# EAGLE design 89c2051-sun-ps2 (EAGLE 4.16)
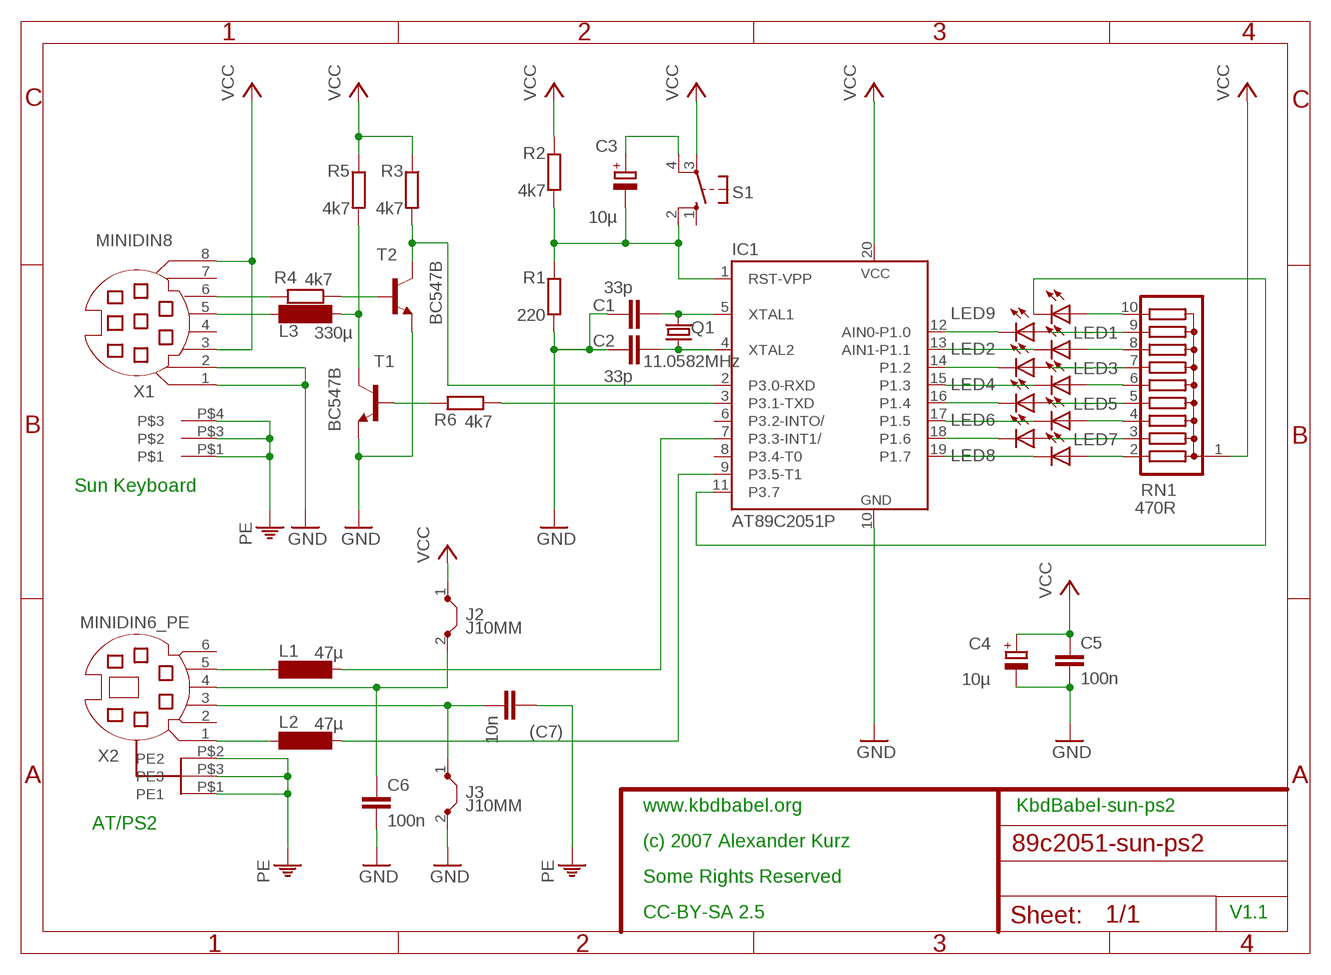
[diagram p0: schematic, sheet 1]

## Parts
(C7)  10n  C-EU025_050-025X075  [C025_050-025X075]
C1  33p  C-EU025-030X050  [C025-030X050]
C2  33p  C-EU025-030X050  [C025-030X050]
C3  10µ  CPOL-EUE2-5  [E2-5]
C4  10µ  CPOL-EUE2-5  [E2-5]
C5  100n  C-EU025_050-025X075  [C025_050-025X075]
C6  100n  C-EU025_050-025X075  [C025_050-025X075]
IC1  AT89C2051P  [DIL20]
J2  J10MM  [10]
J3  J10MM  [10]
L1  47µ  SD75  [SD75]
L2  47µ  SD75  [SD75]
L3  330µ  SD75  [SD75]
LED1  LEDSQR2X5  [LED2X5]
LED2  LEDSQR2X5  [LED2X5]
LED3  LEDSQR2X5  [LED2X5]
LED4  LEDSQR2X5  [LED2X5]
LED5  LEDSQR2X5  [LED2X5]
LED6  LEDSQR2X5  [LED2X5]
LED7  LEDSQR2X5  [LED2X5]
LED8  LEDSQR2X5  [LED2X5]
LED9  LEDSQR2X5  [LED2X5]
Q1  11.0582MHz  CRYSTALHC49U70  [HC49U70]
R1  220  R-EU_0204/7  [0204/7]
R2  4k7  R-EU_0204/7  [0204/7]
R3  4k7  R-EU_0204/7  [0204/7]
R4  4k7  R-EU_0204/7  [0204/7]
R5  4k7  R-EU_0204/7  [0204/7]
R6  4k7  R-EU_0204/7  [0204/7]
RN1  470R  G09R  [SIL10]
S1  10-XX  [B3F-10XX]
T1  BC547B  [TO92]
T2  BC547B  [TO92]
X1  MINIDIN8  [MINIDIN8]
X2  MINIDIN6_PE  [MINIDIN6_PE]

## Nets
GND: C1.1 C2.2 C4.- C5.2 C6.2 IC1.10(GND) J3.2 R1.2 T1.1(E) T2.1(E) X1.1 X1.2
N$1: C1.2 IC1.5(XTAL1) Q1.2
N$2: C2.1 IC1.4(XTAL2) Q1.1
N$3: L1.1 X2.5
N$4: LED1.A RN1.9
N$5: IC1.17(P1.5) LED6.K(C)
N$6: IC1.3(P3.1-TXD) R6.1
N$7: (C7).2 J3.1 X2.3
N$8: IC1.12(AIN0-P1.0) LED1.K(C)
N$9: C3.- IC1.1(RST-VPP) R1.1 R2.2 S1.2(S1)
N$10: C6.1 J2.2 X2.4
N$11: IC1.7(P3.3-INT1/) L1.2
N$12: IC1.9(P3.5-T1) L2.2
N$13: IC1.13(AIN1-P1.1) LED2.K(C)
N$14: LED3.A RN1.7
N$15: IC1.15(P1.3) LED4.K(C)
N$16: LED5.A RN1.5
N$17: LED2.A RN1.8
N$18: LED4.A RN1.6
N$19: LED6.A RN1.4
N$20: IC1.18(P1.6) LED7.K(C)
N$21: LED8.A RN1.2
N$22: LED7.A RN1.3
N$23: IC1.19(P1.7) LED8.K(C)
N$24: IC1.16(P1.4) LED5.K(C)
N$25: IC1.14(P1.2) LED3.K(C)
N$26: L2.1 X2.1
N$27: LED9.A RN1.10
N$28: IC1.11(P3.7) LED9.K(C)
N$29: R4.2 X1.6
N$30: R4.1 T2.2(B)
N$31: L3.1 X1.5
N$32: IC1.2(P3.0-RXD) R3.2 T2.3(C)
N$33: L3.2 R5.2 T1.3(C)
N$34: R6.2 T1.2(B)
N$36: C3.+ S1.4(P1)
PE: (C7).1 X1.P$1 X1.P$3 X1.P$4 X2.P$1(PE1) X2.P$2(PE2) X2.P$3(PE3)
VCC: C4.+ C5.1 IC1.20(VCC) J2.1 R2.1 R3.1 R5.1 RN1.1 S1.3(P) X1.3 X1.8
Unconnected: IC1.6(P3.2-INTO/) IC1.8(P3.4-T0) S1.1(S) X1.4 X1.7 X2.2 X2.6

## Notes on the sheet
- Sun Keyboard
- www.kbdbabel.org | KbdBabel-sun-ps2
- AT/PS2
- (c) 2007 Alexander Kurz
- Some Rights Reserved
- CC-BY-SA 2.5 | V1.1

## Library data of the parts
(C7) C1 C2 C5 C6 = rcl:C-EU: CAPACITOR, European symbol
C3 C4 = rcl:CPOL-EU: POLARIZED CAPACITOR, European symbol
IC1 = atmel:AT89C2051: 80C31 MICROCONTROLLER 2 Kbytes FLASH 2.7 V
J2 J3 = jumper:J: Bridge
L1-L3 = inductor-neosid:SD75: INDUCTOR nominal inductance, E12
LED1-LED9 = led:LED: LED OSRAM: - CHIPLED LG R971, LG N971, LY N971, LG Q971, LY Q971, LO R971, LY R971 LH N974, LH R974 LS Q976, LO Q976, LY Q976 LO Q996 - Hyper CHIPLED LW Q18S LB Q993, LB Q99A, LB R99A - SideLED LS A670, LO A670, LY A670, LG A670, LP A670 LB A673, LV A673, LT A673, LW A673 LH A674 LY A675 LS A676, LA A676, LO A676, LY A676, LW A676 LS A679, LY A679, LG A679 - Hyper Micro SIDELED® LS Y876, LA Y876, LO Y876, LY Y876 LT Y87S - SmartLED LW L88C, LW L88S LB L89C, LB L89S, LG L890 LS L89K, LO L89K, LY L89K LS L896, LA L896, LO L896, LY L896 - TOPLED LS T670, LO T670, LY T670, LG T670, LP T670 LSG T670, LSP T670, LSY T670, LOP T670, LYG T670 LG T671, LOG T671, LSG T671 LB T673, LV T673, LT T673, LW T673 LH T674 LS T676, LA T676, LO T676, LY T676, LB T676, LH T676, LSB T676, LW T676 LB T67C, LV T67C, LT T67C, LS T67K, LO T67K, LY T67K, LW E67C LS E67B, LA E67B, LO E67B, LY E67B, LB E67C, LV E67C, LT E67C LW T67C LS T679, LY T679, LG T679 LS T770, LO T770, LY T770, LG T770, LP T770 LB T773, LV T773, LT T773, LW T773 LH T774 LS E675, LA E675, LY E675, LS T675 LS T776, LA T776, LO T776, LY T776, LB T776 LHGB T686 LT T68C, LB T68C - Hyper Mini TOPLED® LB M676 - Mini TOPLED Santana® LG M470 LS M47K, LO M47K, LY M47K Source: http://www.osram.convergy.de - LUMILED® LXK2-PW12-R00, LXK2-PW12-S00, LXK2-PW14-U00, LXK2-PW14-V00 LXK2-PM12-R00, LXK2-PM12-S00, LXK2-PM14-U00 LXK2-PE12-Q00, LXK2-PE12-R00, LXK2-PE12-S00, LXK2-PE14-T00, LXK2-PE14-U00 LXK2-PB12-K00, LXK2-PB12-L00, LXK2-PB12-M00, LXK2-PB14-N00, LXK2-PB14-P00, LXK2-PB14-Q00 LXK2-PR12-L00, LXK2-PR12-M00, LXK2-PR14-Q00, LXK2-PR14-R00 LXK2-PD12-Q00, LXK2-PD12-R00, LXK2-PD12-S00 LXK2-PH12-R00, LXK2-PH12-S00 LXK2-PL12-P00, LXK2-PL12-Q00, LXK2-PL12-R00 Source: www.luxeon.com
Q1 = crystal:CRYSTAL: CRYSTAL
R1-R6 = rcl:R-EU_: RESISTOR, European symbol
RN1 = resistor-sil:G09R: SIL RESISTOR
S1 = switch-omron:10-XX: OMRON SWITCH
T1 T2 = transistor-npn:BC547*: NPN Transistor
X1 = bla:MINIDIN8
X2 = bla:MINIDIN6_PE

## Board
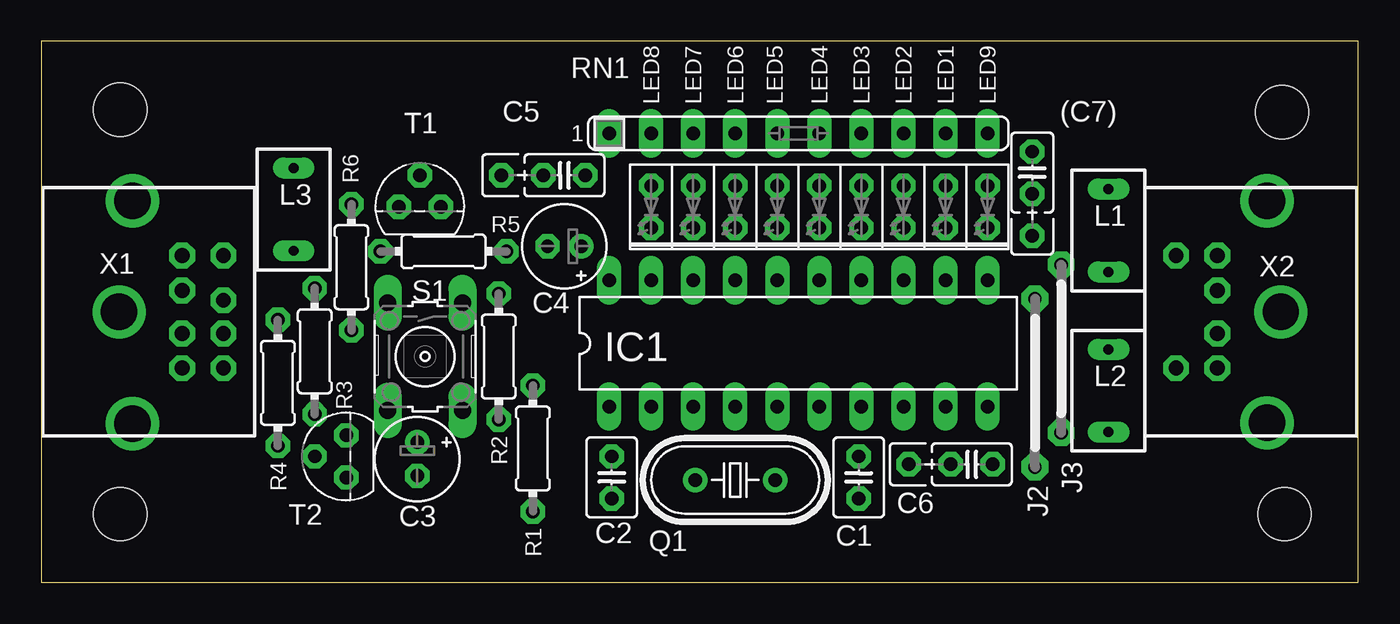
[diagram p1: board, top side]
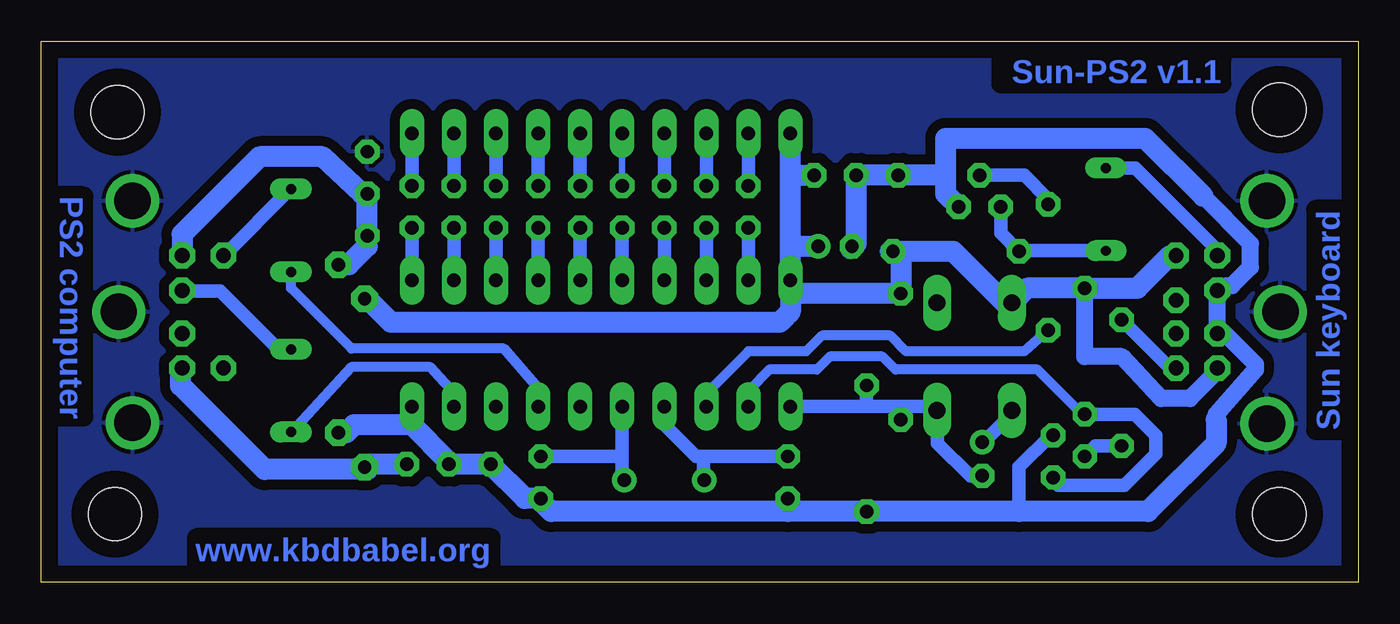
[diagram p2: board, bottom side, seen from below]

Size 79.52 x 32.69 mm. Coordinates in mm from the lower left corner, seen from the top.
Outline: 79.52,0 79.52,32.69 0,32.69 0,0 79.52,0
Copper layers (1*16): Top 0.035mm / dielectric 1.5mm / Bottom 0.035mm
Design rules "default": minimum track width 16mil, minimum drill 24mil, track to track 16mil, track to pad 16mil, pad to pad 16mil, via to via 16mil, smd to smd 16mil, copper to edge 40mil, drill to drill 8mil, minimum pad ring 13mil, minimum via ring 8mil, stop-mask expansion 4mil, vias tented up to drill 0mil, thermal gap 10mil
Holes 3.2 mm at 75.08,4.12 74.92,28.41 4.76,28.57 4.76,4.12

### Footprints (pad centres in the part's own frame; a part is rotated, then mirrored left to right if it is on the bottom)
C025_050-025X075 = drill 0.813 octagon: 1 -1.27,0; 2 1.27,0; 3 3.81,0
C025-030X050 = drill 0.813 octagon: 1 -1.27,0; 2 1.27,0
E2-5 = drill 0.813 pad 1.27 round: + -1.016,0 | drill 0.813 pad 1.27 octagon: - 1.016,0
DIL20 = drill 0.813 long: 1 -11.43,-3.81; 2 -8.89,-3.81; 3 -6.35,-3.81; 4 -3.81,-3.81; 5 -1.27,-3.81; 6 1.27,-3.81; 7 3.81,-3.81; 8 6.35,-3.81; 9 8.89,-3.81; 10 11.43,-3.81; 11 11.43,3.81; 12 8.89,3.81; 13 6.35,3.81; 14 3.81,3.81; 15 1.27,3.81; 16 -1.27,3.81; 17 -3.81,3.81; 18 -6.35,3.81; 19 -8.89,3.81; 20 -11.43,3.81
10 = drill 0.813 pad 1.6 octagon: 1 -5.08,0; 2 5.08,0
SD75 = drill 0.6 long: 1 -2.5,0; 2 2.5,0
LED2X5 = drill 0.813 octagon: A -1.27,0; K 1.27,0
HC49U70 = drill 0.813 round: 1 -2.413,0; 2 2.413,0
0204/7 = drill 0.813 octagon: 1 -3.81,0; 2 3.81,0
SIL10 = drill 0.813 long: 1 -11.43,0; 2 -8.89,0; 3 -6.35,0; 4 -3.81,0; 5 -1.27,0; 6 1.27,0; 7 3.81,0; 8 6.35,0; 9 8.89,0; 10 11.43,0
B3F-10XX = drill 1.016 long: 1 -3.251,2.261; 2 3.251,2.261; 3 -3.251,-2.261; 4 3.251,-2.261
TO92 = drill 0.813 octagon: 1 1.27,0; 2 0,1.905; 3 -1.27,0
MINIDIN8 = drill 0.9 octagon: 1 1.3,0.88; 2 -1.3,0.88; 3 3.4,0.88; 4 1.3,3.38; 5 -3.4,0.88; 6 3.4,3.38; 7 -0.7,3.38; 8 -3.4,3.38 | drill 2.2 round: P$1 -6.706,-2.108; P$3 0,-2.921; P$4 6.756,-2.108
MINIDIN6_PE = drill 0.9 octagon: 1 1.3,2.15; 2 -1.3,2.15; 3 3.4,2.15; 4 -3.4,2.15; 5 3.4,4.65; 6 -3.4,4.65 | drill 2.2 round: P$1 0,-1.676; P$2 -6.706,-0.838; P$3 6.706,-0.838

### Placement (x,y rotation side)
(C7)  59.84,24.76 270 top
C1  49.37,6.34 90 top
C2  34.44,6.34 270 top
C3  22.7,7.46 270 top
C4  31.59,20.31 180 top
C5  31.59,24.6 180 top
C6  56.19,7.14 180 top
IC1  45.71,14.44 0 top
J2  60,12.06 270 top
J3  61.59,14.12 270 top
L1  64.45,21.27 270 top
L2  64.45,11.58 270 top
L3  15.23,22.54 270 top
LED1  54.6,22.7 270 top
LED2  52.06,22.7 270 top
LED3  49.52,22.7 270 top
LED4  46.98,22.7 270 top
LED5  44.44,22.7 270 top
LED6  41.9,22.7 270 top
LED7  39.36,22.7 270 top
LED8  36.82,22.7 270 top
LED9  57.14,22.7 270 top
Q1  41.9,6.19 0 top
R1  29.68,8.09 270 top
R2  27.62,13.65 270 top
R3  16.5,13.96 270 top
R4  14.28,12.06 90 top
R5  24.28,20 180 top
R6  18.73,19.04 90 top
RN1  45.71,27.14 0 top
S1  23.17,13.65 270 top
T1  22.85,22.7 0 top
T2  18.41,7.61 90 top
X1  7.62,16.34 270 top
X2  73.18,16.34 90 top

### Tracks (layer width: path | path; a pad name or v marks a point on that pad's centre or on a via)
GND
  Bottom 0.813: T2.1 18.57,8.88 20.47,6.98 20.47,4.28
  Bottom 1.016: 9.36,23.33 | 9.36,23.33 6.5,20.47 6.5,19.04 7.61,17.93 7.93,17.93 8.41,17.46 8.49,17.54 X1.2 X1.1 | X1.1 8.49,14.99 8.57,14.92 | 8.57,9.84 8.57,10.15 6.19,12.85 6.19,13.17 8.09,15.07 8.12,15.04 X1.1
  Bottom 1.27: 57.14,9.52 IC1.10 | 49.52,5.07 50.32,5.07 52.38,7.14 C6.2 54.92,7.3 57.14,9.52 | J3.2 61.11,9.04 60.64,9.52 57.14,9.52 | 8.57,9.84 8.57,8.41 12.69,4.28 20.47,4.28 R1.2 34.44,4.28 | 9.36,23.33 | 9.36,23.33 12.85,26.82 24.92,26.82 24.92,24.6 | T1.1 24.92,23.49 24.92,24.6 | 24.92,24.6 C5.2 30.32,20.47 30.47,20.31 | 24.92,24.6 | 30.47,20.31 30.63,20.15 | 30.47,20.31 C4.- | 49.52,5.07 C1.1 | 34.44,4.28 48.73,4.28 49.52,5.07 | 34.44,4.28 C2.2 | 34.44,4.28 | T1.1
N$1
  Bottom 0.813: 44.29,6.18 | Q1.2 44.29,6.18 | 44.44,7.61 44.44,6.34 44.29,6.18 | 44.44,7.61 IC1.5 | 44.44,7.61 | 44.44,7.61 C1.2
N$2
  Bottom 0.813: C2.1 39.52,7.61 | 39.52,7.61 40,7.61 41.9,9.52 41.9,10.79 | 41.9,10.79 | 41.9,10.79 IC1.4 | Q1.1 39.52,6.18 39.52,7.61
N$3
  Bottom 0.813: 68.53,19.72 68.57,19.68 | X2.5 68.53,19.72 | L1.1 64.49,23.77 68.53,19.72
N$4
  Bottom 0.813: LED1.A RN1.9
N$5
  Bottom 0.813: IC1.17 LED6.K
N$6
  Bottom 0.61: IC1.3 39.36,11.42 36.82,13.96 33.33,13.96 32.38,14.92 28.25,14.92 27.3,13.96 20.16,13.96 R6.1
N$7
  Bottom 1.27: J3.1 60.95,19.2 59.84,20.31 (C7).2 | (C7).2 | X2.3 71.03,21.03 66.35,25.71 62.54,25.71 60.16,23.49 | 60.16,23.49 | (C7).2 60.16,23.49
N$8
  Bottom 0.813: IC1.12 LED1.K
N$9
  Bottom 0.813: 27.62,10.63 25.71,10.63 25.43,10.35 | 27.62,10.63 29.84,10.63 | 29.84,10.63 IC1.1 | C3.- 23.43,6.44 25.39,8.41 25.39,10.31 25.43,10.35 | 25.43,10.35 S1.2 | 27.62,10.63 | 27.62,10.63 R2.2 | 27.62,10.63 | 29.84,10.63 | R1.1 29.68,10.79 29.84,10.63
N$10
  Bottom 1.27: 59.68,7.14 J2.2 59.53,7.14 | C6.1 59.53,7.14 | 59.53,7.14 59.68,7.14 | 59.68,7.14 | 59.53,7.14 59.84,6.82 66.03,6.82 71.11,11.9 71.11,13.01 71.05,12.94 X2.4
N$11
  Bottom 0.61: IC1.7 49.52,11.74 51.59,14.12 60.8,14.12 64.45,17.77 L1.2
N$12
  Bottom 0.61: IC1.9 54.6,11.42 56.03,13.01 60.8,13.01 64.45,9.04 L2.2
N$13
  Bottom 0.813: IC1.13 LED2.K
N$14
  Bottom 0.813: LED3.A RN1.7
N$15
  Bottom 0.813: IC1.15 LED4.K
N$16
  Bottom 0.406: LED5.A RN1.5
N$17
  Bottom 0.813: LED2.A RN1.8
N$18
  Bottom 0.406: LED4.A RN1.6
  Bottom 0.813: LED4.A RN1.6
N$19
  Bottom 0.406: LED6.A RN1.4
  Bottom 0.813: LED6.A RN1.4
N$20
  Bottom 0.813: IC1.18 LED7.K
N$21
  Bottom 0.813: LED8.A RN1.2
N$22
  Bottom 0.813: LED7.A RN1.3
N$23
  Bottom 0.813: IC1.19 LED8.K
N$24
  Bottom 0.813: IC1.16 LED5.K
N$25
  Bottom 0.813: IC1.14 LED3.K
N$26
  Bottom 0.813: L2.1 65.2,14.08 68.73,17.61 71.11,17.61 71.08,17.64 X2.1
N$27
  Bottom 0.813: LED9.A RN1.10
N$28
  Bottom 0.813: IC1.11 LED9.K
N$29
  Bottom 0.813: R4.2 11.36,12.94 X1.6
N$30
  Bottom 0.813: R4.1 15.87,8.25 T2.2
N$31
  Bottom 0.813: X1.5 8.49,19.91 8.41,20 13.45,25.04 L3.1
N$32
  Bottom 0.61: IC1.2 36.82,11.58 35.55,12.85 32.7,12.85 31.9,13.65 28.73,13.65 27.93,12.85 19.36,12.85 16.5,9.99 R3.2
  Bottom 0.813: T2.3 18.57,6.34 18.09,5.87 14.12,5.87 12.22,7.77 12.22,8.88 13.49,10.15 R3.2 | R3.2
N$33
  Bottom 0.813: L3.2 20.59,20.04 20.63,20 R5.2 | R5.2 20.63,20.15 | R5.2 21.58,21.11 | 21.58,21.11 | 21.58,21.11 T1.3
N$34
  Bottom 0.813: R6.2 18.73,23.17 20.16,24.6 T1.2
N$36
  Bottom 0.813: 22.7,8.41 | C3.+ 22.7,8.41 | S1.4 20.91,10.19 22.7,8.41
PE
  pour Bottom (isolate 0.61): -0.16,-0.17 79.69,-0.17 79.69,32.85 -0.16,32.85
VCC
  Bottom 1.016: X1.3 8.49,12.77 10.15,11.11 11.9,11.11 14.28,13.65 16.5,13.65 R3.1 | R3.1
  Bottom 1.27: 34.28,17.46 34.28,16.34 34.6,16.03 | 34.28,17.46 IC1.20 34.28,20.31 | 34.6,16.03 34.92,15.71 58.41,15.71 | 34.28,20.31 34.28,24.6 | 34.28,24.6 RN1.1 | J2.1 59.68,16.98 58.41,15.71 | 58.41,15.71 | X1.8 11.36,19.74 13.33,17.77 R3.1 | R3.1 | R3.1 | 20.91,16.86 20.95,16.82 21.27,16.82 24.44,20 27.62,20 | 20.91,16.86 S1.3 20.91,16.94 | R3.1 20,17.77 20.91,16.86 | 34.28,24.6 C5.1 | 34.28,24.6 | 34.28,20.31 C4.+ | 34.28,20.31 | 34.6,16.03 | 34.6,16.03 | 27.62,20 28.25,20 R5.1 27.62,20 | 27.62,20 | 27.62,20 | 34.28,17.46 R2.1 27.62,20 | 34.28,17.46

### Text on the board
Bottom: Sun-PS2 v1.1 | PS2 computer | Sun keyboard | www.kbdbabel.org